# EAGLE design compressor (EAGLE 7.3.0)
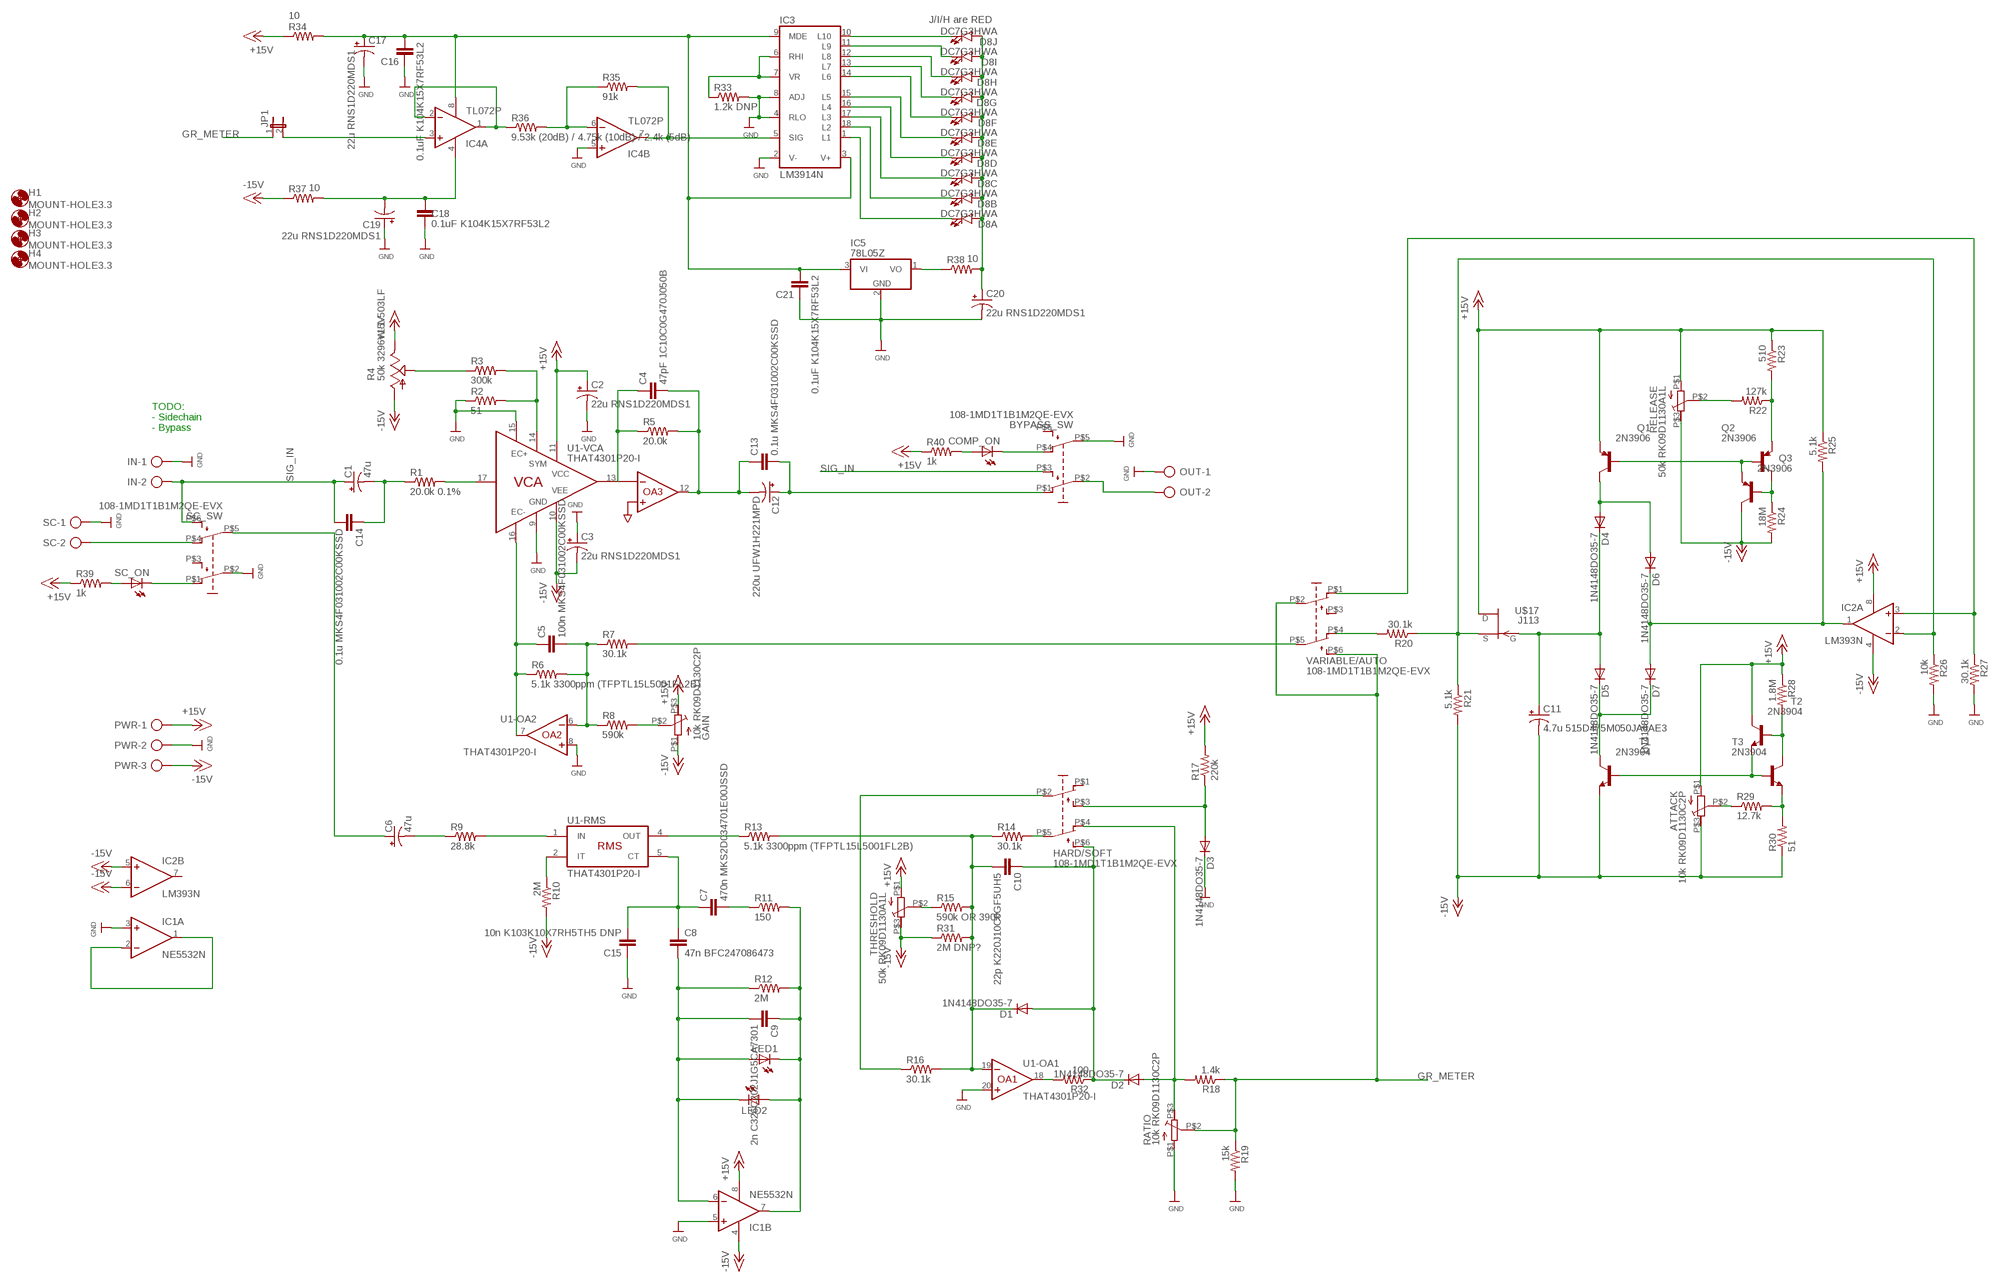
[diagram p0: schematic, sheet 1]

## Parts
ATTACK  10k RK09D1130C2P  ALPS-RK09D  [ALPS-RK09D1130]
BYPASS_SW  108-1MD1T1B1M2QE-EVX  [108-1MD1T1B1M2QE-EVX]
C1  47u  CPOL-USB45181D  [B45181D]
C2  22u RNS1D220MDS1  CPOL-USE2.5-7  [E2,5-7]
C3  22u RNS1D220MDS1  CPOL-USE2.5-7  [E2,5-7]
C4  47pF 1C10C0G470J050B  C-EU025-060X050  [C025-060X050]
C5  100n MKS4F031002C00KSSD  C7.5/4  [C7.5B4]
C6  47u  CPOL-USB45181D  [B45181D]
C7  470n MKS2D034701E00JSSD  C5/4.5  [C5B4.5]
C8  47n BFC247086473  C5/7.2  [C5B7.2]
C9  2n C326C202J1G5CA7301  C5/2.5  [C5B2.5]
C10  22p K220J10C0GF5UH5  C-EU050-035X075  [C050-035X075]
C11  4.7u 515D475M050JA6AE3  CPOL-USE2-5  [E2-5]
C12  220u UFW1H221MPD  CPOL-USE5-10.5  [E5-10,5]
C13  0.1u MKS4F031002C00KSSD  C7.5/4  [C7.5B4]
C14  0.1u MKS4F031002C00KSSD  C7.5/4  [C7.5B4]
C15  10n K103K10X7RH5TH5 DNP  C-EU050-025X075  [C050-025X075]
C16  0.1uF K104K15X7RF53L2  C-EU025-024X044  [C025-024X044]
C17  22u RNS1D220MDS1  CPOL-USE2.5-7  [E2,5-7]
C18  0.1uF K104K15X7RF53L2  C-EU025-024X044  [C025-024X044]
C19  22u RNS1D220MDS1  CPOL-USE2.5-7  [E2,5-7]
C20  22u RNS1D220MDS1  CPOL-USE2.5-7  [E2,5-7]
C21  0.1uF K104K15X7RF53L2  C-EU025-024X044  [C025-024X044]
COMP_ON  LED5MM  [LED5MM]
D1  1N4148DO35-7  [DO35-7]
D2  1N4148DO35-7  [DO35-7]
D3  1N4148DO35-7  [DO35-7]
D4  1N4148DO35-7  [DO35-7]
D5  1N4148DO35-7  [DO35-7]
D6  1N4148DO35-7  [DO35-7]
D7  1N4148DO35-7  [DO35-7]
D8  DC7G3HWA  LED_BARGRAPH_10  [LED_BARGAPH_10]
GAIN  10k RK09D1130C2P  ALPS-RK09D  [ALPS-RK09D1130]
H1  MOUNT-HOLE3.3  [3,3]
H2  MOUNT-HOLE3.3  [3,3]
H3  MOUNT-HOLE3.3  [3,3]
H4  MOUNT-HOLE3.3  [3,3]
HARD/SOFT  108-1MD1T1B1M2QE-EVX  [108-1MD1T1B1M2QE-EVX]
IC1  NE5532N  [DIL08]
IC2  LM393N  [DIL08]
IC3  LM3914N  [DIL18]
IC4  TL072P  [DIL08]
IC5  78L05Z  [TO92]
IN  AK500/2  [AK500/2]
JP1  JP1E  [JP1]
LED1  LED5MM  [LED5MM]
LED2  LED5MM  [LED5MM]
OUT  AK500/2  [AK500/2]
PWR  AK500/3  [AK500/3]
Q1  2N3906  [TO92]
Q2  2N3906  [TO92]
Q3  2N3906  [TO92]
R1  20.0k 0.1%  R-US_0204/7  [0204/7]
R2  51  R-US_0204/7  [0204/7]
R3  300k  R-US_0204/7  [0204/7]
R4  50k 3296W-1-503LF  TRIM_US-S64W  [S64W]
R5  20.0k  R-US_0204/7  [0204/7]
R6  5.1k 3300ppm (TFPTL15L5001FL2B)  R-US_0204/7  [0204/7]
R7  30.1k  R-US_0204/7  [0204/7]
R8  590k  R-US_0204/7  [0204/7]
R9  28.8k  R-US_0204/7  [0204/7]
R10  2M  R-US_0204/7  [0204/7]
R11  150  R-US_0204/7  [0204/7]
R12  2M  R-US_0204/7  [0204/7]
R13  5.1k 3300ppm (TFPTL15L5001FL2B)  R-US_0204/7  [0204/7]
R14  30.1k  R-US_0204/7  [0204/7]
R15  590k OR 390k  R-US_0204/7  [0204/7]
R16  30.1k  R-US_0204/7  [0204/7]
R17  220k  R-US_0204/7  [0204/7]
R18  1.4k  R-US_0204/7  [0204/7]
R19  15k  R-US_0204/7  [0204/7]
R20  30.1k  R-US_0204/7  [0204/7]
R21  5.1k  R-US_0204/7  [0204/7]
R22  127k  R-US_0204/7  [0204/7]
R23  510  R-US_0204/7  [0204/7]
R24  18M  R-US_0204/7  [0204/7]
R25  5.1k  R-US_0204/7  [0204/7]
R26  10k  R-US_0204/7  [0204/7]
R27  30.1k  R-US_0204/7  [0204/7]
R28  1.8M  R-US_0204/7  [0204/7]
R29  12.7k  R-US_0204/7  [0204/7]
R30  51  R-US_0204/7  [0204/7]
R31  2M DNP?  R-US_0204/7  [0204/7]
R32  100  R-US_0204/7  [0204/7]
R33  1.2k DNP  R-US_0204/7  [0204/7]
R34  10  R-US_0204/7  [0204/7]
R35  91k  R-US_0204/7  [0204/7]
R36  9.53k (20dB) / 4.75k (10dB) / 2.4k (5dB)  R-US_0204/7  [0204/7]
R37  10  R-US_0204/7  [0204/7]
R38  10  R-US_0204/7  [0204/7]
R39  1k  R-US_0204/7  [0204/7]
R40  1k  R-US_0204/7  [0204/7]
RATIO  10k RK09D1130C2P  ALPS-RK09D  [ALPS-RK09D1130]
RELEASE  50k RK09D1130A1L  ALPS-RK09D  [ALPS-RK09D1130]
SC  AK500/2  [AK500/2]
SC_ON  LED5MM  [LED5MM]
SC_SW  108-1MD1T1B1M2QE-EVX  [108-1MD1T1B1M2QE-EVX]
T1  2N3904  [TO92]
T2  2N3904  [TO92]
T3  2N3904  [TO92]
THRESHOLD  50k RK09D1130A1L  ALPS-RK09D  [ALPS-RK09D1130]
U1  THAT4301P20-I  [DIL20]
U$17  J113  [J113-TO92]
VARIABLE/AUTO  108-1MD1T1B1M2QE-EVX  [108-1MD1T1B1M2QE-EVX]

## Nets
+15V: ATTACK.P$1(E) C2.+ GAIN.P$3(A) IC1.8(P:V+) IC2.8(P:V+) PWR.1 Q1.3(E) R4.E R17.2 R23.1 R25.1 R28.1 R34.1 R39.1 R40.1 RELEASE.P$1(E) T2.1(C) THRESHOLD.P$1(E) U1.11(-VCA:VCC) U$17.D
-15V: ATTACK.P$3(A) C3.- C11.- GAIN.P$1(E) IC1.4(P:V-) IC2.4(P:V-) IC2.5(B:+IN) IC2.6(B:-IN) PWR.3 Q3.1(C) R4.A R10.2 R21.2 R24.2 R30.1 R31.1 R37.1 RELEASE.P$3(A) T1.3(E) THRESHOLD.P$3(A) U1.10(-VCA:VEE)
GND: BYPASS_SW.P$5(P1) C2.- C3.+ C15.1 C16.1 C17.- C18.1 C19.+ C20.- C21.1 D3.C IC1.3(A:+IN) IC1.5(B:+IN) IC3.2(V-) IC3.4(RLO) IC3.8(ADJ) IC4.5(B:+IN) IC5.2(GND) IN.1 OUT.1 PWR.2 R2.1 R19.2 R26.2 R27.2 R33.2 RATIO.P$1(E) SC.1 SC_SW.P$2(P) U1.8(-OA2:+IN) U1.9(-VCA:GND) U1.15(-VCA:EC+) U1.20(-OA1:+IN)
GR_METER: JP1.1 R18.1 R19.1 RATIO.P$2(S) VARIABLE/AUTO.P$2(P) VARIABLE/AUTO.P$6(S1)
N$1: SC.2 SC_SW.P$4(O1)
N$2: C1.- C14.1 R1.1
N$3: R1.2 U1.17(-VCA:IN)
N$4: R3.1 R4.S
N$5: C4.2 C12.- C13.1 R5.2 U1.12(-VCA:OA3_OUT)
N$6: R2.2 R3.2 U1.14(-VCA:SYM)
N$7: C4.1 R5.1 U1.13(-VCA:VCA_OUT)
N$8: C5.1 R6.1 U1.7(-OA2:OUT) U1.16(-VCA:EC-)
N$9: C5.2 R6.2 R7.1 R8.1 U1.6(-OA2:-IN)
N$10: IC5.1(VO) R38.1
N$11: GAIN.P$2(S) R8.2
N$12: R13.1 U1.4(-RMS:RMS-OUT)
N$13: C6.- R9.1
N$14: R9.2 U1.1(-RMS:RMS-IN)
N$15: R10.1 U1.2(-RMS:RMS-IT)
N$16: C7.2 R11.1
N$17: C7.1 C8.1 C15.2 U1.5(-RMS:RMS-CT)
N$18: C9.1 IC1.7(B:OUT) LED1.K(C) LED2.A R11.2 R12.2
N$19: C8.2 C9.2 IC1.6(B:-IN) LED1.A LED2.K(C) R12.1
N$20: C10.2 D1.C R13.2 R14.1 R15.2 R16.2 R31.2 U1.19(-OA1:-IN)
N$21: R15.1 THRESHOLD.P$2(S)
N$22: HARD/SOFT.P$5(P1) R14.2
N$23: C10.1 D1.A D2.C HARD/SOFT.P$6(S1) R32.1
N$24: D2.A HARD/SOFT.P$4(O1) R18.2 RATIO.P$3(A)
N$25: HARD/SOFT.P$2(P) R16.1
N$26: D3.A HARD/SOFT.P$3(S) R17.1
N$27: IC2.2(A:-IN) R20.1 R21.1 R26.1 U$17.S
N$28: SC_ON.K(C) SC_SW.P$1(O)
N$29: R20.2 VARIABLE/AUTO.P$4(O1)
N$30: IC2.3(A:+IN) R27.1 VARIABLE/AUTO.P$1(O)
N$31: C11.+ D4.C D5.A U$17.G
N$32: D5.C D7.C T1.1(C)
N$33: D4.A D6.A Q1.1(C)
N$34: R22.2 RELEASE.P$2(S)
N$35: D6.C D7.A IC2.1(A:OUT) R25.2
N$36: Q2.3(E) R22.1 R23.2
N$37: Q1.2(B) Q2.2(B) Q3.3(E)
N$38: Q2.1(C) Q3.2(B) R24.1
N$39: T1.2(B) T2.3(E) T3.2(B)
N$40: R28.2 T2.2(B) T3.1(C)
N$41: BYPASS_SW.P$1(O) C12.+ C13.2
N$42: R32.2 U1.18(-OA1:OUT)
N$43: D8.11(J:C) IC3.10(L10)
N$44: ATTACK.P$2(S) R29.1
N$45: R29.2 R30.2 T3.3(E)
N$46: D8.12(I:C) IC3.11(L9)
N$47: D8.13(H:C) IC3.12(L8)
N$48: D8.14(G:C) IC3.13(L7)
N$49: D8.15(F:C) IC3.14(L6)
N$50: D8.16(E:C) IC3.15(L5)
N$51: D8.17(D:C) IC3.16(L4)
N$52: D8.18(C:C) IC3.17(L3)
N$53: D8.19(B:C) IC3.18(L2)
N$54: D8.20(A:C) IC3.1(L1)
N$55: IC3.6(RHI) IC3.7(VR) R33.1
N$56: R39.2 SC_ON.A
N$57: BYPASS_SW.P$2(P) OUT.2
N$58: IC3.5(SIG) IC4.7(B:OUT) R35.2
N$59: IC4.6(B:-IN) R35.1 R36.2
N$60: IC4.1(A:OUT) IC4.2(A:-IN) R36.1
N$61: C18.2 C19.- IC4.4(P:V-) R37.2
N$62: C20.+ D8.1(A:A) D8.2(B:A) D8.3(C:A) D8.4(D:A) D8.5(E:A) D8.6(F:A) D8.7(G:A) D8.8(H:A) D8.9(I:A) D8.10(J:A) R38.2
N$63: C16.2 C17.+ C21.2 IC3.3(V+) IC3.9(MDE) IC4.8(P:V+) IC5.3(VI) R34.2
N$64: BYPASS_SW.P$4(O1) COMP_ON.K(C)
N$65: COMP_ON.A R40.2
N$66: R7.2 VARIABLE/AUTO.P$5(P1)
N$67: IC4.3(A:+IN) JP1.2
N$68: IC1.1(A:OUT) IC1.2(A:-IN)
SC_IN: C6.+ SC_SW.P$5(P1)
SIG_IN: BYPASS_SW.P$3(S) C1.+ C14.2 IN.2 SC_SW.P$6(S1)
Unconnected: BYPASS_SW.P$6(S1) HARD/SOFT.P$1(O) IC2.7(B:OUT) SC_SW.P$3(S) VARIABLE/AUTO.P$3(S)

## Notes on the sheet
- J/I/H are RED
- TODO:
  - Sidechain
  - Bypass

## Library data of the parts
ATTACK GAIN RATIO RELEASE THRESHOLD = keves:ALPS-RK09D; OC_NEWARK: unknown
BYPASS_SW HARD/SOFT SC_SW VARIABLE/AUTO = keves:108-1MD1T1B1M2QE-EVX; OC_NEWARK: unknown
C1 = rcl:CPOL-US: POLARIZED CAPACITOR, American symbol
C2 C3 C11 C12 C17 C19 C20 = rcl:CPOL-US: POLARIZED CAPACITOR, American symbol; OC_NEWARK: unknown
C4 C10 C15 C16 C18 C21 = rcl:C-EU: CAPACITOR, European symbol; OC_NEWARK: unknown
C5 C7-C9 C13 C14 = capacitor-wima:C: CAPACITOR naming: grid - package width; OC_NEWARK: unknown
C6 = rcl:CPOL-US: POLARIZED CAPACITOR, American symbol; MPN: ERJ-1TRQFR47U; OC_NEWARK: 01X1464
COMP_ON LED1 LED2 SC_ON = led:LED: LED OSRAM: - CHIPLED LG R971, LG N971, LY N971, LG Q971, LY Q971, LO R971, LY R971 LH N974, LH R974 LS Q976, LO Q976, LY Q976 LO Q996 - Hyper CHIPLED LW Q18S LB Q993, LB Q99A, LB R99A - SideLED LS A670, LO A670, LY A670, LG A670, LP A670 LB A673, LV A673, LT A673, LW A673 LH A674 LY A675 LS A676, LA A676, LO A676, LY A676, LW A676 LS A679, LY A679, LG A679 - Hyper Micro SIDELED® LS Y876, LA Y876, LO Y876, LY Y876 LT Y87S - SmartLED LW L88C, LW L88S LB L89C, LB L89S, LG L890 LS L89K, LO L89K, LY L89K LS L896, LA L896, LO L896, LY L896 - TOPLED LS T670, LO T670, LY T670, LG T670, LP T670 LSG T670, LSP T670, LSY T670, LOP T670, LYG T670 LG T671, LOG T671, LSG T671 LB T673, LV T673, LT T673, LW T673 LH T674 LS T676, LA T676, LO T676, LY T676, LB T676, LH T676, LSB T676, LW T676 LB T67C, LV T67C, LT T67C, LS T67K, LO T67K, LY T67K, LW E67C LS E67B, LA E67B, LO E67B, LY E67B, LB E67C, LV E67C, LT E67C LW T67C LS T679, LY T679, LG T679 LS T770, LO T770, LY T770, LG T770, LP T770 LB T773, LV T773, LT T773, LW T773 LH T774 LS E675, LA E675, LY E675, LS T675 LS T776, LA T776, LO T776, LY T776, LB T776 LHGB T686 LT T68C, LB T68C - Hyper Mini TOPLED® LB M676 - Mini TOPLED Santana® LG M470 LS M47K, LO M47K, LY M47K Source: http://www.osram.convergy.de LUXEON: - LUMILED® LXK2-PW12-R00, LXK2-PW12-S00, LXK2-PW14-U00, LXK2-PW14-V00 LXK2-PM12-R00, LXK2-PM12-S00, LXK2-PM14-U00 LXK2-PE12-Q00, LXK2-PE12-R00, LXK2-PE12-S00, LXK2-PE14-T00, LXK2-PE14-U00 LXK2-PB12-K00, LXK2-PB12-L00, LXK2-PB12-M00, LXK2-PB14-N00, LXK2-PB14-P00, LXK2-PB14-Q00 LXK2-PR12-L00, LXK2-PR12-M00, LXK2-PR14-Q00, LXK2-PR14-R00 LXK2-PD12-Q00, LXK2-PD12-R00, LXK2-PD12-S00 LXK2-PH12-R00, LXK2-PH12-S00 LXK2-PL12-P00, LXK2-PL12-Q00, LXK2-PL12-R00 Source: www.luxeon.com KINGBRIGHT: KA-3528ASYC Source: www.kingbright.com; OC_NEWARK: unknown
D1-D7 = diode:1N4148: DIODE high speed (Philips); OC_NEWARK: unknown
D8 = SparkFun-LED:LED_BARGRAPH_10: 10-Segment LED Bar Graph SFE part numbers: COM-09935 (red, Vf = 2.1V, Ifmax = 20mA) COM-09936 (yellow, Vf = 2.1V, Ifmax = 20mA) COM-09937 (blue, Vf = 3.4V, Ifmax = 20mA) COM-09938 (green, Vf = 3.4V, Ifmax = 20mA); OC_NEWARK: unknown
H1-H4 = holes:MOUNT-HOLE: MOUNTING HOLE with drill center marker; OC_NEWARK: unknown
IC1 = linear:NE5532: AUDIO AMPLIFIER; OC_NEWARK: unknown
IC2 = linear:LM393: COMPARATOR; OC_NEWARK: unknown
IC3 = linear:LM3914N: LED DRIVER senses analog voltage levels and drives 10 LEDs; OC_NEWARK: unknown
IC4 = linear:TL072: OP AMP; OC_NEWARK: unknown
IC5 = linear:78*: Positive VOLTAGE REGULATOR Source: http://cache.national.com/ds/LM/LM78L05.pdf http://www.fairchildsemi.com/ds/LM/LM7805.pdf; OC_NEWARK: unknown
IN OUT SC = con-ptr500:AK500/2: CONNECTOR; OC_FARNELL: unknown; OC_NEWARK: unknown
JP1 = jumper:JP1E: JUMPER; OC_NEWARK: unknown
PWR = con-ptr500:AK500/3: CONNECTOR; OC_FARNELL: unknown; OC_NEWARK: unknown
Q1-Q3 = transistor-pnp:2N3906: PNP Transistor; OC_NEWARK: unknown
R1-R3 R5-R40 = rcl:R-US_: RESISTOR, American symbol; OC_NEWARK: unknown
R4 = pot:TRIM_US-: POTENTIOMETER; OC_NEWARK: unknown
T1-T3 = transistor:2N3904: NPN TRANSISTOR; OC_NEWARK: unknown
U1 = that-corp:THAT4301: Analog Engine IC IC Dynamics Processor; OC_NEWARK: unknown
U$17 = keves:J113; OC_NEWARK: unknown

## Net classes
1 +15v: width 0.559 mm
2 -15v: width 0.559 mm

## Board
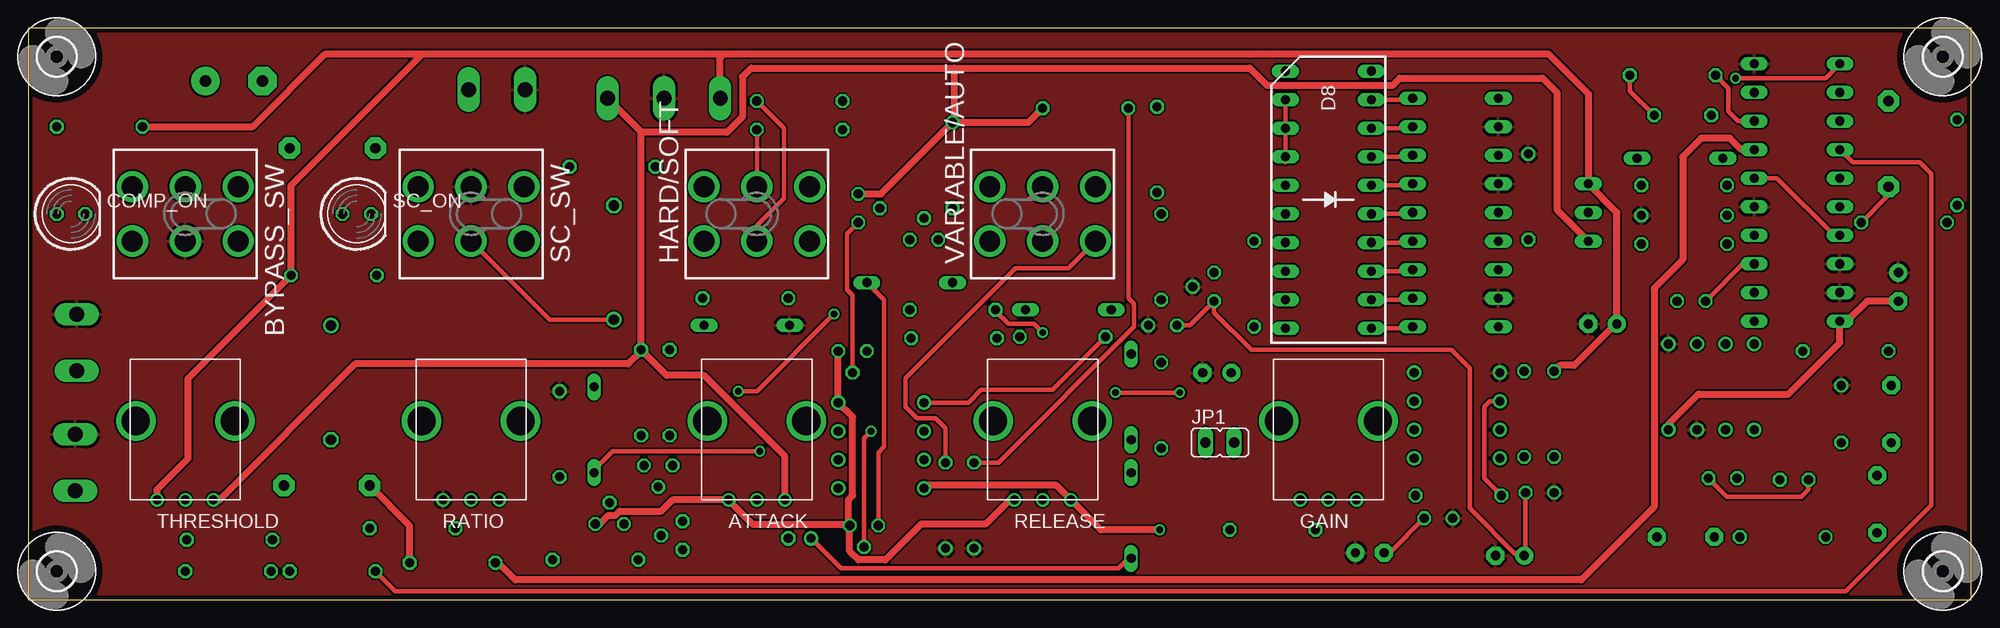
[diagram p1: board, top side]
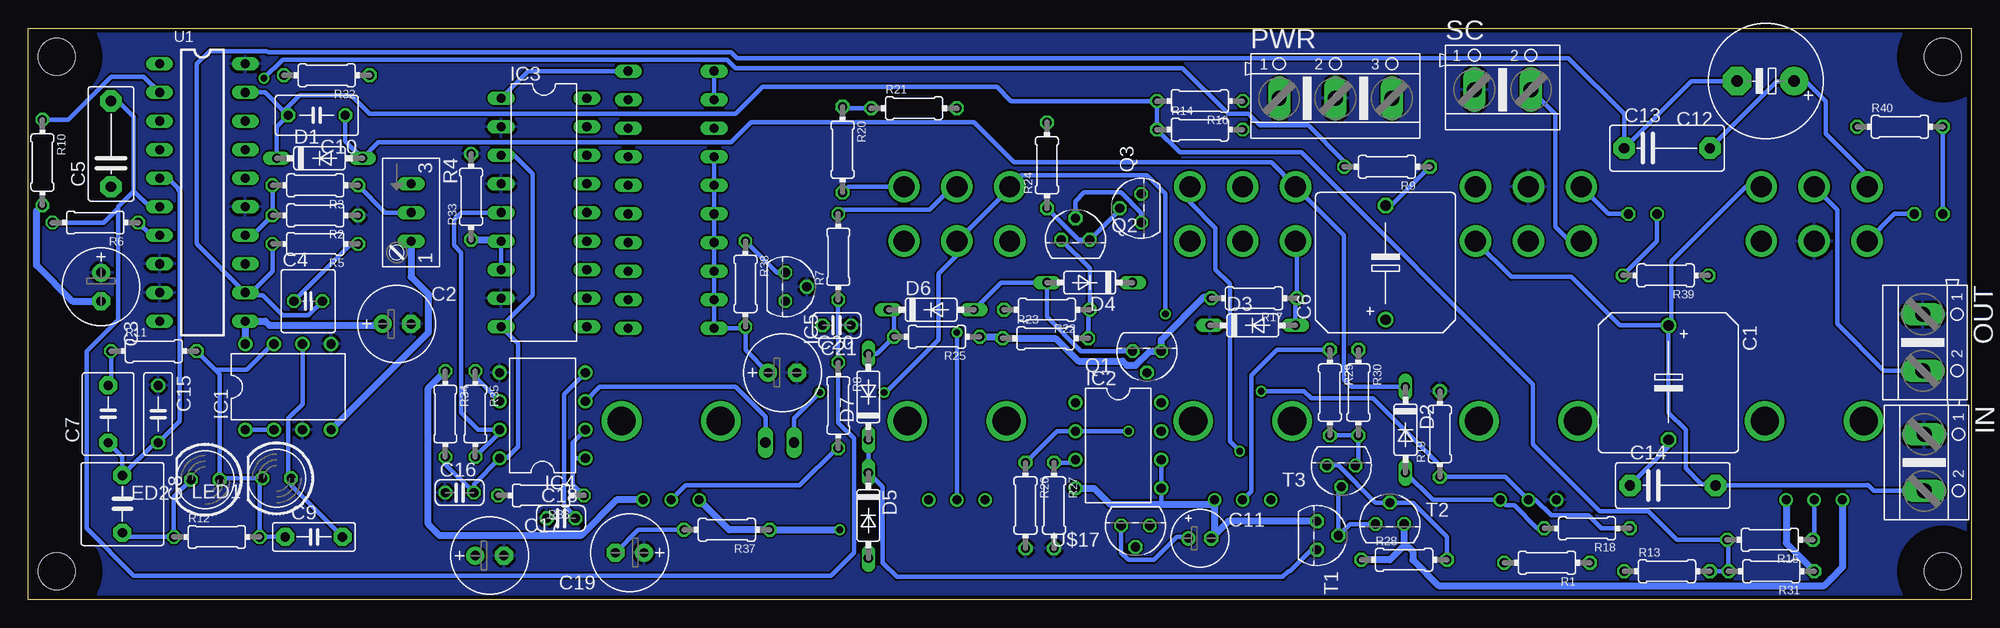
[diagram p2: board, bottom side, seen from below]

Size 172.72 x 50.8 mm. Coordinates in mm from the lower left corner, seen from the top.
Outline: 0,0 172.72,0 172.72,50.8 0,50.8 0,0
Copper layers (1*16): Top 0.0356mm / dielectric 1.5011mm / Bottom 0.0356mm
Design rules "oshpark *": minimum track width 6mil, minimum drill 13mil, track to track 6mil, track to pad 6mil, pad to pad 6mil, via to via 6mil, smd to smd 6mil, copper to edge 15mil, drill to drill 6mil, minimum pad ring 7mil, minimum via ring 7mil, stop-mask expansion 3mil, vias tented up to drill 0mil, thermal gap 10mil

### Footprints (pad centres in the part's own frame; a part is rotated, then mirrored left to right if it is on the bottom)
ALPS-RK09D1130 = drill 0.8: P$1 -2.5,0; P$2 0,0; P$3 2.5,0 | drill 2.5: P$4 -4.4,7; P$5 4.4,7
108-1MD1T1B1M2QE-EVX = drill 1.86: P$1 -2.415,-4.7; P$2 -2.415,0; P$3 -2.415,4.7; P$4 2.415,-4.7; P$5 2.415,0; P$6 2.415,4.7
B45181D = drill 0.914: + -5.08,0 | drill 0.914 octagon: - 5.08,0
E2,5-7 = drill 0.813 pad 1.6: + -1.27,0 | drill 0.813 pad 1.6 octagon: - 1.27,0
C025-060X050 = drill 0.813 octagon: 1 -1.27,0; 2 1.27,0
C7.5B4 = drill 0.914 pad 1.905 octagon: 1 -3.81,0; 2 3.81,0
C5B4.5 = drill 0.813 pad 1.6 octagon: 1 -2.54,0; 2 2.54,0
C5B7.2 = drill 0.813 pad 1.6 octagon: 1 -2.54,0; 2 2.54,0
C5B2.5 = drill 0.813 pad 1.6 octagon: 1 -2.54,0; 2 2.54,0
C050-035X075 = drill 0.813 octagon: 1 -2.54,0; 2 2.54,0
E2-5 = drill 0.813 pad 1.27: + -1.016,0 | drill 0.813 pad 1.27 octagon: - 1.016,0
E5-10,5 = drill 1.016 pad 2.54: + -2.54,0 | drill 1.016 pad 2.54 octagon: - 2.54,0
C050-025X075 = drill 0.813 octagon: 1 -2.54,0; 2 2.54,0
C025-024X044 = drill 0.813 octagon: 1 -1.27,0; 2 1.27,0
LED5MM = drill 0.813 octagon: A -1.27,0; K 1.27,0
DO35-7 = drill 0.813 long: A 3.81,0; C -3.81,0
LED_BARGAPH_10 = drill 0.813 long: 1 -11.43,-3.81; 2 -8.89,-3.81; 3 -6.35,-3.81; 4 -3.81,-3.81; 5 -1.27,-3.81; 6 1.27,-3.81; 7 3.81,-3.81; 8 6.35,-3.81; 9 8.89,-3.81; 10 11.43,-3.81; 11 11.43,3.81; 12 8.89,3.81; 13 6.35,3.81; 14 3.81,3.81; 15 1.27,3.81; 16 -1.27,3.81; 17 -3.81,3.81; 18 -6.35,3.81; 19 -8.89,3.81; 20 -11.43,3.81
3,3 = hole 3.3: 0,0
DIL08 = drill 0.813 pad 1.27: 1 -3.81,-3.81; 2 -1.27,-3.81; 3 1.27,-3.81; 4 3.81,-3.81; 5 3.81,3.81; 6 1.27,3.81; 7 -1.27,3.81; 8 -3.81,3.81
DIL18 = drill 0.813 long: 1 -10.16,-3.81; 2 -7.62,-3.81; 3 -5.08,-3.81; 4 -2.54,-3.81; 5 0,-3.81; 6 2.54,-3.81; 7 5.08,-3.81; 8 7.62,-3.81; 9 10.16,-3.81; 10 10.16,3.81; 11 7.62,3.81; 12 5.08,3.81; 13 2.54,3.81; 14 0,3.81; 15 -2.54,3.81; 16 -5.08,3.81; 17 -7.62,3.81; 18 -10.16,3.81
TO92 = drill 0.813 octagon: 1 -1.27,0; 2 0,1.905; 3 1.27,0
AK500/2 = drill 1.321 long: 1 -2.515,0; 2 2.515,0
JP1 = drill 0.914 long: 1 0,-1.27; 2 0,1.27
AK500/3 = drill 1.321 long: 1 -5.004,0; 2 0,0; 3 5.004,0
TO92' = drill 0.813 octagon: 1 1.27,0; 2 0,1.905; 3 -1.27,0
0204/7 = drill 0.813 octagon: 1 -3.81,0; 2 3.81,0
S64W = drill 0.813 long: A 2.54,1.27; E -2.54,1.27; S 0,1.27
DIL20 = drill 0.813 long: 1 -11.43,-3.81; 2 -8.89,-3.81; 3 -6.35,-3.81; 4 -3.81,-3.81; 5 -1.27,-3.81; 6 1.27,-3.81; 7 3.81,-3.81; 8 6.35,-3.81; 9 8.89,-3.81; 10 11.43,-3.81; 11 11.43,3.81; 12 8.89,3.81; 13 6.35,3.81; 14 3.81,3.81; 15 1.27,3.81; 16 -1.27,3.81; 17 -3.81,3.81; 18 -6.35,3.81; 19 -8.89,3.81; 20 -11.43,3.81
J113-TO92 = drill 0.813 octagon: D -1.27,0; G 1.27,0; S 0,1.905

### Placement (x,y rotation side)
ATTACK  64.77,8.89 0 top
BYPASS_SW  13.97,34.29 270 top
C1  26.92,19.3 270 bottom
C2  139.95,24.51 0 bottom
C3  166.24,27.81 270 bottom
C4  147.83,26.54 0 bottom
C5  165.35,40.51 90 bottom
C6  52.07,29.97 90 bottom
C7  165.61,16.51 90 bottom
C8  164.34,8.51 270 bottom
C9  147.32,5.59 0 bottom
C10  147.07,43.05 180 bottom
C11  68.58,5.46 0 bottom
C12  18.29,46.1 180 bottom
C13  27.05,40.13 0 bottom
C14  26.54,10.16 0 bottom
C15  161.16,16.51 270 bottom
C16  134.37,9.53 0 bottom
C17  131.7,3.94 0 bottom
C18  125.35,7.24 0 bottom
C19  119.25,4.19 180 bottom
C20  105.66,20.19 0 bottom
C21  100.84,24.38 180 bottom
COMP_ON  3.81,34.29 0 top
D1  146.81,39.24 0 bottom
D2  50.29,15.11 270 bottom
D3  63.88,24.38 0 bottom
D4  78.36,28.19 180 bottom
D5  98.04,7.49 270 bottom
D6  92.46,25.78 0 bottom
D7  98.04,18.03 90 bottom
D8  115.57,35.56 270 top
GAIN  115.57,8.89 0 top
H1  2.54,2.54 0 top
H2  2.54,48.26 0 top
H3  170.18,2.54 0 top
H4  170.18,48.26 0 top
HARD/SOFT  64.77,34.29 90 top
IC1  149.61,18.92 0 bottom
IC2  75.82,13.72 270 bottom
IC3  126.87,34.42 270 bottom
IC4  127,16.38 90 bottom
IC5  105.41,27.81 270 bottom
IN  4.19,12.19 270 bottom
JP1  105.92,13.97 270 top
LED1  150.62,10.79 180 bottom
LED2  156.97,10.67 180 bottom
OUT  4.32,22.86 270 bottom
PWR  56.52,44.58 0 bottom
Q1  2N3906  [TO92']  73.28,22.1 180 bottom
Q2  2N3906  [TO92']  79.63,32 0 bottom
Q3  2N3906  [TO92']  73.79,34.8 90 bottom
R1  37.72,3.3 180 bottom
R2  147.19,34.16 180 bottom
R3  147.19,36.83 180 bottom
R4  139.95,34.42 270 bottom
R5  147.19,31.62 180 bottom
R6  166.75,33.53 180 bottom
R7  100.71,30.48 90 bottom
R8  100.71,17.27 270 bottom
R9  51.94,38.48 180 bottom
R10  171.45,38.86 270 bottom
R11  161.54,22.1 0 bottom
R12  155.96,5.59 0 bottom
R13  27.05,2.54 0 bottom
R14  68.58,41.78 0 bottom
R15  17.91,5.33 180 bottom
R16  68.58,44.32 180 bottom
R17  63.75,26.8 180 bottom
R18  34.16,6.35 180 bottom
R19  47.24,14.73 90 bottom
R20  100.33,40.01 270 bottom
R21  93.98,43.69 0 bottom
R22  82.17,25.78 180 bottom
R23  82.3,23.24 0 bottom
R24  82.17,38.61 90 bottom
R25  91.95,23.37 180 bottom
R26  84.07,8.38 270 bottom
R27  81.53,8.38 270 bottom
R28  50.42,3.56 0 bottom
R29  57.02,18.41 270 bottom
R30  54.48,18.41 270 bottom
R31  17.78,2.54 180 bottom
R32  146.18,46.61 180 bottom
R33  133.35,35.81 90 bottom
R34  135.64,16.51 270 bottom
R35  132.97,16.51 270 bottom
R36  127.13,9.27 180 bottom
R37  110.62,6.22 180 bottom
R38  108.97,28.07 270 bottom
R39  27.18,28.83 180 bottom
R40  6.35,42.04 0 bottom
RATIO  39.37,8.89 0 top
RELEASE  90.17,8.89 0 top
SC  41.66,45.34 0 bottom
SC_ON  29.21,34.29 0 top
SC_SW  39.37,34.29 270 top
T1  2N3904  [TO92']  58.17,5.71 270 bottom
T2  2N3904  [TO92']  51.69,6.73 0 bottom
T3  2N3904  [TO92']  56.01,11.94 180 bottom
THRESHOLD  13.97,8.89 0 top
U1  157.23,36.2 270 bottom
U$17  74.3,6.6 180 bottom
VARIABLE/AUTO  90.17,34.29 90 top

### Tracks (layer width: path | path; a pad name or v marks a point on that pad's centre or on a via)
+15V
  Top 0.61: R40.1 19.94,42.04 26.42,48.51 35.05,48.51 | 35.05,48.51 23.37,36.83 R39.1 14.22,19.68 14.22,12.57 11.47,9.82 THRESHOLD.P$1 | 35.05,48.51 61.85,48.51 | 61.85,48.51 135.13,48.51 138.68,44.96 R4.E 141.22,34.42 C2.+ 141.1,24.38 140.97,24.38 137.41,20.83 136.14,20.83 R34.1 | PWR.1 61.52,48.18 61.85,48.51 | T2.1 50.8,6.73 51.56,7.49 52.2,7.49 52.58,7.87 56.26,7.87 57.28,8.89 ATTACK.P$1 62.27,8.85 64.39,6.73 72.9,6.73 U$17.D 73.03,4.32 73.79,3.56 76.2,3.56 79.38,6.73 85.09,6.73 87.25,8.89 RELEASE.P$1 | IC2.8 Q1.3
  Top 0.635: 72.9,6.73 72.9,8.89 73.28,9.27 73.28,16.26 IC2.8
  Bottom 0.61: IC1.8 U1.11 151.64,24.77 151.26,24.38 141.35,24.38 C2.+ | R25.1 86.23,23.37 R23.1 81.41,23.24 79.38,21.21 75.44,21.21 75.06,20.83 74.3,20.83 73.03,22.1 Q1.3 72.01,23.11 68.2,26.92 67.69,26.92 R17.2 | GAIN.P$3 120.4,8.89 123.57,5.71 136.14,5.71 137.16,6.73 137.16,18.8 R34.1 | 11.43,7.11 11.43,8.85 THRESHOLD.P$1 | 50.42,5.08 49.66,4.32 49.66,3.56 47.37,1.27 13.08,1.27 12.51,1.84
  Bottom 0.635: T2.1 50.42,5.08 50.42,4.83 51.69,3.56 R28.1 | 12.51,1.84 11.43,2.92 11.43,7.11 | 11.56,8.8 THRESHOLD.P$1
-15V  (via drill 0.6)
  Top 0.61: R30.1 54.48,41.6 | 54.48,41.6 PWR.3 51.51,45.41 | THRESHOLD.P$3 17.02,8.89 29.08,20.95 53.34,20.95 54.48,22.1 R30.1 | R4.A 135.89,34.67 135.89,45.09 134.62,46.35 121.92,46.35 121.28,45.72 110.11,45.72 108.58,47.24 82.3,47.24 64.26,47.24 63.5,46.48 63.5,42.93 62.1,41.53 54.56,41.53 54.48,41.6 | ATTACK.P$3 67.27,12.74 60.07,19.94 56.77,19.94 R30.1 | C3.- 163.45,26.54 161.8,24.89 161.16,24.89 U1.10 161.04,22.86 156.46,18.29 148.46,18.29 145.8,15.62 IC1.4 | Q3.1 75.82,36.07 R24.2 82.68,42.42 88.9,42.42 R21.2 | v100.58,6.22 95.34,6.22 RELEASE.P$3 91.4,10.16 79.88,10.16 IC2.4
  Top 0.635: 82.3,47.24 82.3,42.8 82.68,42.42
  Bottom 0.406: IC2.6 IC2.5 72.01,8.89 72.01,8.64 72.14,8.51
  Bottom 0.61: THRESHOLD.P$3 16.47,5.04 R31.1 | T1.3 66.04,6.99 C11.- 67.27,5.75 67.27,8.38 | ATTACK.P$3 67.27,8.38 | C3.- 168.78,26.54 171.96,29.72 171.96,34.54 R10.2 | GAIN.P$1 110.4,6.22 R37.1 v100.58,6.22 | R4.A 138.68,28.7 137.16,27.18 137.16,23.75 IC1.4 | IC2.4 77.98,9.91 76.58,8.51 72.14,8.51 67.4,8.51 67.27,8.38
GND
  pour Top: -2.41,50.8 187.45,50.8 187.45,-5.97 -2.16,-5.97 -2.16,50.16
  pour Bottom: -1.78,51.44 188.09,51.44 188.09,-5.33 -1.52,-5.33 -1.52,50.8
GR_METER  (via drill 0.6)
  Top 0.406: v63.12,18.54 64.77,18.54 v71.63,25.4 | v96.65,18.41 v102.36,18.41
  Bottom 0.406: R18.1 32.89,6.35 34.04,7.49 37.34,7.49 38.73,8.89 RATIO.P$2 41.4,10.92 R19.1 47.24,11.94 53.21,17.91 58.67,17.91 59.31,18.54 v63.12,18.54 | v71.63,25.4 71.63,36.07 73.28,37.72 84.46,37.72 VARIABLE/AUTO.P$6 85.47,36.58 VARIABLE/AUTO.P$2 90.17,30.61 91.82,28.96 91.82,23.11 96.52,18.41 v96.65,18.41 | JP1.1 104.65,16.13 v102.36,18.41
N$1
  Bottom 0.406: SC_SW.P$4 35.69,31.88 36.96,33.15 36.96,43.16 SC.2
N$2
  Top 0.61: R1.1 33.91,6.6 C14.1
  Bottom 0.406: C1.- 26.92,13.59 C14.1
N$3
  Top 0.61: U1.17 152.27,40.01 151.26,41.02 148.72,41.02 147.07,39.37 147.07,30.23 144.53,27.69 144.53,8.26 138.05,1.78 43.31,1.78 41.78,3.3 R1.2
N$4
  Bottom 0.406: R4.S 140.97,34.42 R3.1
N$5
  Bottom 0.406: U1.12 152.91,27.3 151,29.21 R5.2 | C4.2 147.83,25.27 150.11,25.27 151.89,27.05 153.16,27.05 U1.12 | C12.- 24.89,46.1 C13.1 30.86,43.18 35.81,48.13 109.73,48.13 110.24,48.64 151.38,48.64 151.51,48.77 156.59,48.77 157.73,47.62 157.73,31.62 U1.12
N$6
  Bottom 0.406: R3.2 R2.2 152.78,32.38 U1.14
N$7
  Top 0.406: U1.13 152.4,29.84 C4.1
  Bottom 0.406: R5.1 144.02,31.62 C4.1
N$8
  Top 0.406: U1.16 155.45,37.47 160.53,32.38 U1.7 | C5.1 165.35,35.94 R6.1
  Bottom 0.406: U1.7 161.8,32.38 R6.1
N$9
  Bottom 0.406: R8.1 100.71,20.07 | R8.1 100.71,15.75 99.31,14.35 99.31,4.19 101.35,2.16 163.32,2.16 167.51,6.35 167.51,22.1 164.72,24.89 164.72,34.8 | 164.72,34.8 164.72,34.92 163.32,36.32 | R8.1 R7.1 | U1.6 161.93,34.92 163.32,36.32 | 163.32,36.32 163.32,42.93 164.72,44.32 C5.2 | R6.2 165.99,33.53 164.72,34.8
N$10
  Bottom 0.406: IC5.1 106.17,29.08 R38.1
N$11
  Bottom 0.406: GAIN.P$2 114.3,10.16 104.14,10.16 100.84,13.46 R8.2
N$12
  Top 0.406: R13.1 32.64,0.76 161.54,0.76 169.16,8.38 169.16,37.85 168.15,38.86 162.18,38.86 U1.4
N$13
  Bottom 0.406: C6.- 51.56,35.05 R9.1
N$14  (via drill 0.6)
  Top 0.406: v151.76,46.35 159.77,46.35 U1.1
  Bottom 0.406: R9.2 55.75,38.99 58.93,42.16 63.25,42.16 64.26,43.18 66.04,43.18 70.1,47.24 109.86,47.24 110.62,48.01 150.11,48.01 v151.76,46.35
N$15
  Bottom 0.406: R10.1 169.16,42.67 165.35,46.48 162.43,46.48 U1.2
N$16
  Bottom 0.406: R11.1 165.35,19.3 C7.2
N$17
  Bottom 0.406: C7.1 164.34,12.7 C8.1 161.42,13.97 C15.2 159.26,15.88 159.26,36.32 159.38,36.45 159.38,36.58 160.27,37.47 U1.5
N$18
  Bottom 0.406: C9.1 R12.2 152.15,10.54 LED1.K 155.57,10.79 LED2.A 155.7,20.07 R11.2 156.08,20.45 153.29,20.45 151,22.73 IC1.7
N$19
  Top 0.406: LED2.K 158.24,9.78 157.61,9.14 151,9.14 LED1.A
  Bottom 0.406: IC1.6 148.34,17.4 149.61,16.13 149.61,11.05 LED1.A 149.35,10.16 C9.2 | LED2.K 159.77,9.14 R12.1 163.96,5.59 C8.2
N$20
  Bottom 0.406: U1.19 151.64,45.09 149.99,43.43 | 149.99,43.43 C10.2 150.62,42.04 D1.C | R13.2 R31.2 21.59,5.21 R15.2 26.16,5.33 28.7,7.87 33.02,7.87 38.99,13.84 38.99,19.18 59.56,39.75 70.36,39.75 R14.1 R16.2 85.34,44.32 86.61,45.59 107.44,45.59 109.86,43.18 142.37,43.18 144.02,44.83 148.59,44.83 149.99,43.43
N$21
  Bottom 0.406: THRESHOLD.P$2 13.97,5.46 R15.1
N$22
  Top 0.406: R14.2 HARD/SOFT.P$5
N$23
  Top 0.406: R32.1 142.37,45.21 C10.1
  Bottom 0.406: C10.1 144.53,40.77 D1.A 141.6,40.64 110.24,40.64 108.46,42.42 88.65,42.42 85.09,38.86 62.23,38.86 HARD/SOFT.P$6 55.75,32.39 55.75,19.56 55.12,18.92 D2.C
N$24  (via drill 0.6)
  Top 0.406: D2.A 50.29,11.56 51.94,13.21 v65.02,13.21
  Bottom 0.406: R18.2 38.61,6.35 40.64,8.38 41.36,8.38 RATIO.P$3 47.88,8.89 D2.A | HARD/SOFT.P$4 69.47,35.31 67.18,33.02 67.18,29.34 65.91,28.07 65.91,14.1 v65.02,13.21
N$25
  Top 0.406: HARD/SOFT.P$2 64.77,33.27 67.18,35.69 67.18,41.91 R16.1
N$26
  Bottom 0.406: D3.A 60.07,26.67 R17.1 59.94,31.75 HARD/SOFT.P$3
N$27  (via drill 0.6)
  Top 0.406: R21.1 97.79,26.8 98.3,26.29 98.3,24.26 86.23,12.19 R26.1 | 74.68,14.73 v74.93,14.99 74.3,14.35 U$17.S
  Bottom 0.406: R26.1 81.28,14.99 IC2.2 v74.93,14.99 | R21.1 100.2,43.69 R20.1
N$28
  Bottom 0.406: SC_ON.K 32.26,34.29 SC_SW.P$1
N$29
  Bottom 0.406: VARIABLE/AUTO.P$4 99.82,36.7 R20.2
N$30
  Top 0.406: R27.1 81.53,15.24 80.64,16.13 78.99,16.13 77.98,17.14 77.98,19.68 87.76,29.46 92.46,29.46 VARIABLE/AUTO.P$1
  Bottom 0.406: R27.1 79.88,12.19 IC2.3
N$31
  Top 0.406: D5.A 97.79,3.68 96.9,2.79 72.26,2.79 C11.+ | U$17.G 75.56,13.08 76.07,13.59 76.07,26.67 D4.C
  Bottom 0.406: U$17.G 75.56,4.19 74.93,3.56 72.64,3.56 70.61,5.59 69.72,5.59 C11.+
N$32
  Bottom 0.406: D7.C D5.C 96.77,10.03 96.77,3.3 95.5,2.03 61.21,2.03 60.71,2.54 60.58,2.54 58.67,4.45 T1.1
N$33
  Bottom 0.406: D6.A 86.23,28.19 D4.A 82.17,25.15 79.12,22.1 Q1.1
N$34  (via drill 0.6)
  Top 0.406: R22.2 85.98,25.65 87.12,24.51 89.41,24.51 v90.17,23.75
  Bottom 0.406: v90.17,23.75 RELEASE.P$2
N$35
  Top 0.406: IC2.1 83.57,17.53 84.71,18.67 91.06,18.67 R25.2
  Bottom 0.406: D7.A 97.28,21.84 R25.2 95.76,25.27 D6.C
N$36
  Bottom 0.406: R23.2 78.49,25.65 R22.1 78.36,29.46 Q2.3
N$37
  Top 0.406: Q1.2 73.28,27.05 72.77,27.56 72.77,32.51 Q3.3
  Bottom 0.406: Q2.2 79.63,35.43 78.87,36.2 75.56,36.2 73.79,34.42 Q3.3
N$38
  Bottom 0.406: Q3.2 75.69,34.67 Q2.1 79.38,32 R24.1
N$39
  Bottom 0.406: T2.3 55.24,6.73 T1.2 56.26,9.78 T3.2
N$40
  Bottom 0.406: R28.2 46.61,5.59 49.66,8.64 T2.2 52.96,8.64 56.26,11.94 T3.1
N$41
  Bottom 0.406: BYPASS_SW.P$1 9.27,37.72 12.95,41.4 12.95,44.32 14.73,46.1 C12.+ 17.27,46.1 C13.2
N$42
  Top 0.406: U1.18 152.02,42.55 151.13,43.43 151.13,45.47 R32.2
N$43
  Top 0.406: D8.11 122.94,24.13 IC3.10
N$44
  Bottom 0.406: R29.1 61.72,22.23 64.01,19.94 64.01,9.65 ATTACK.P$2
N$45
  Bottom 0.406: R29.2 R30.2 54.48,12.19 T3.3
N$46
  Top 0.406: D8.12 122.94,26.67 IC3.11
N$47
  Top 0.406: D8.13 122.94,29.21 IC3.12
N$48
  Top 0.406: D8.14 122.94,31.75 IC3.13
N$49
  Top 0.406: D8.15 122.94,34.29 IC3.14
N$50
  Top 0.406: D8.16 122.94,36.83 IC3.15
N$51
  Top 0.406: D8.17 122.94,39.37 IC3.16
N$52
  Top 0.406: D8.18 122.94,41.91 IC3.17
N$53
  Top 0.406: D8.19 122.94,44.45 IC3.18
N$54
  Bottom 0.406: D8.20 128.27,46.99 IC3.1
N$55
  Bottom 0.406: IC3.6 IC3.7
  Bottom 0.61: R33.1 130.81,32 IC3.6
N$56
  Bottom 0.406: SC_ON.A 27.94,31.88 R39.2
N$57
  Bottom 0.406: OUT.2 7.77,20.34 11.94,24.51 11.94,34.67 BYPASS_SW.P$2
N$58
  Bottom 0.406: R35.2 130.81,14.86 IC4.7 132.72,15.11 134.24,16.64 134.24,30.86 134.87,31.5 134.87,33.78 134.24,34.42 IC3.5
N$59
  Top 0.406: IC4.6 129.92,17.65 129.41,17.14 129.41,10.79 R36.2
  Bottom 0.406: R35.1 132.97,19.81 IC4.6
N$60
  Bottom 0.406: IC4.2 124.33,13.97 124.33,12.7 | 124.33,12.7 124.33,10.29 R36.1 | IC4.1 124.21,12.57 124.33,12.7
N$61
  Top 0.406: C19.- 121.03,4.19 C18.2
  Bottom 0.406: R37.2 118.49,6.22 C19.- | C18.2 124.08,7.37 125.09,8.38 125.09,18.29 IC4.4
N$62
  Top 0.406: D8.2 D8.3 D8.4 111.76,38.86
  Bottom 0.406: D8.1 D8.2 | D8.4 D8.5 D8.6 D8.7 D8.8 D8.9 D8.10 109.09,24.13 R38.2 108.97,22.23 C20.+
N$63
  Top 0.406: C21.2 103.25,24.38 IC5.3 105.41,25.53 108.71,22.23 126.49,22.23 128.14,20.57 128.14,8.13 132.21,4.06 132.84,4.06 C17.+ 133.1,4.06 C16.2
  Bottom 0.406: R34.2 135.64,12.06 C16.2 133.1,10.29 IC4.8 130.18,12.57 129.16,13.59 129.16,22.73 IC3.9 127.89,27.05 127.89,37.85 129.54,39.5 IC3.3
N$64
  Bottom 0.406: COMP_ON.K 6.86,34.29 BYPASS_SW.P$4
N$65
  Bottom 0.406: R40.2 COMP_ON.A
N$66
  Bottom 0.406: VARIABLE/AUTO.P$5 90.55,36.7 92.58,34.67 100.33,34.67 R7.2
N$67
  Bottom 0.406: JP1.2 107.19,16.26 109.86,18.92 121.92,18.92 IC4.3
N$68
  Bottom 0.406: IC1.1 IC1.2
SC_IN
  Top 0.406: C6.+ 46.35,24.89 SC_SW.P$5
SIG_IN
  Bottom 0.406: BYPASS_SW.P$3 20.06,36.7 26.67,30.1 26.67,24.64 C1.+ | C1.+ 31.24,24.38 35.56,28.7 40.9,28.7 SC_SW.P$6 | IN.2 8.66,9.68 9.21,10.22 9.27,10.16 C14.2 22.86,10.29 24,10.29 25.4,11.68 25.4,15.11 26.92,16.64 C1.+